# Altium project Plate.PrjPcb
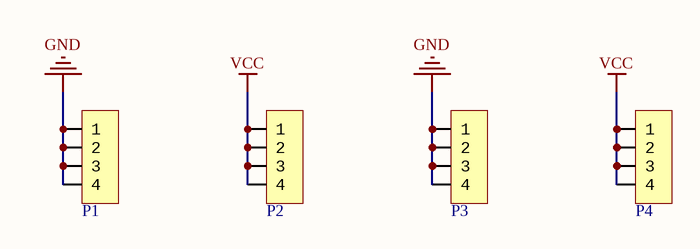
[diagram p0: Plate.SchDoc]
1 sheet, 4 parts. Net scope: global (net labels, ports and power ports of the same name join across sheets).
Board file: Plate.PcbDoc

## Sheet Plate.SchDoc
size A4; SheetNumber: 1; SheetTotal: 1

### Parts
P1  HDR1x4_2.54  [HDR_1X4]  (value not drawn)
P2  HDR1x4_2.54  [HDR_1X4]  (value not drawn)
P3  HDR1x4_2.54  [HDR_1X4]  (value not drawn)
P4  HDR1x4_2.54  [HDR_1X4]  (value not drawn)

### Nets
GND: P1.1 P1.2 P1.3 P1.4 P3.1 P3.2 P3.3 P3.4
VCC: P2.1 P2.2 P2.3 P2.4 P4.1 P4.2 P4.3 P4.4

### Library data of the parts
P1-P4 = HDR1x4_2.54: Header